# EAGLE design wifi-hat (EAGLE 7.5.0)
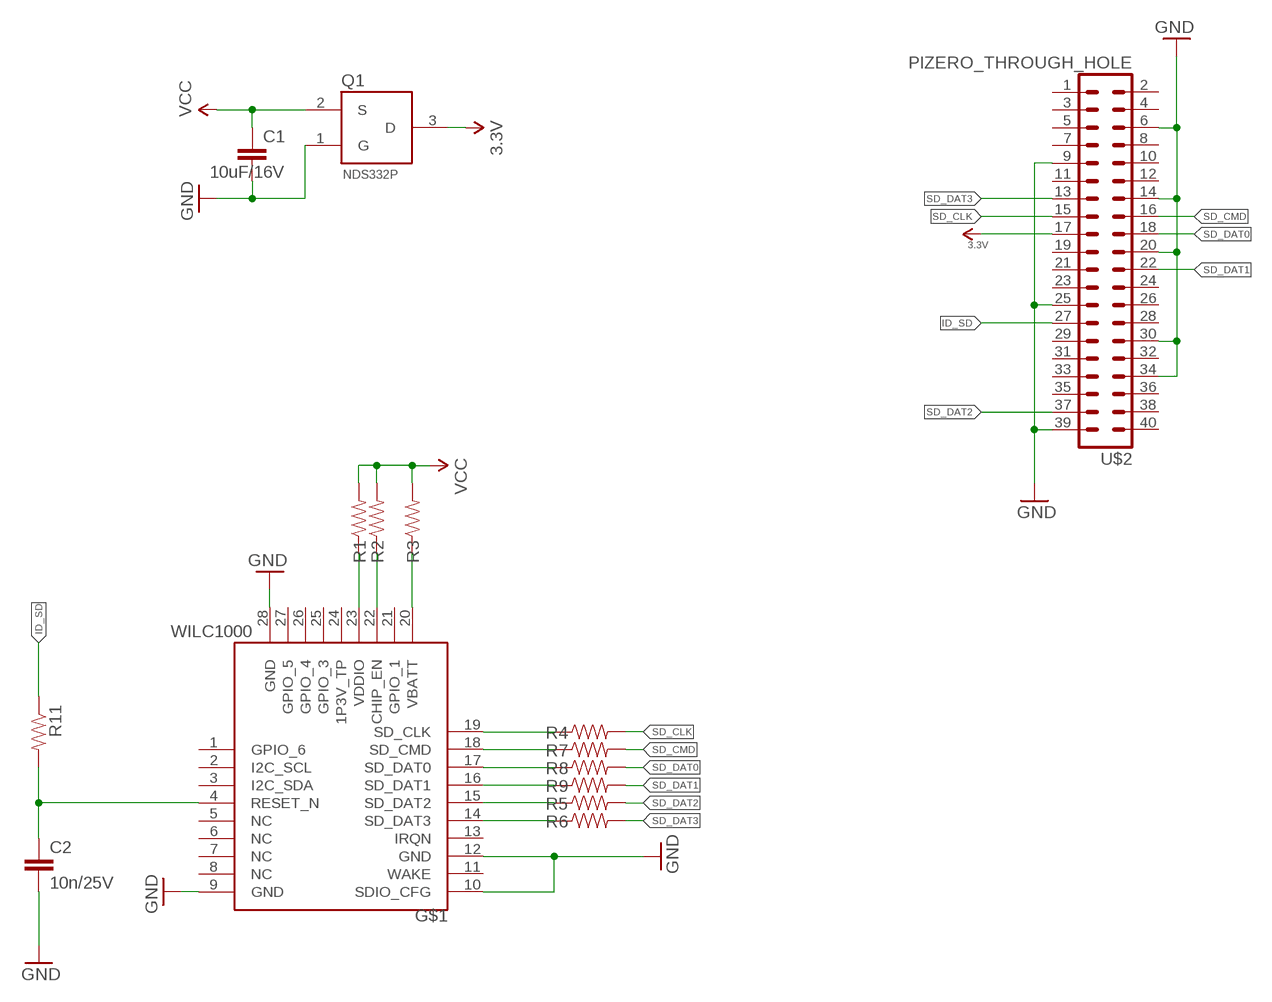
[diagram p0: schematic, sheet 1]

## Parts
C1  10uF/16V  C-EUC0603K  [C0603K]
C2  10n/25V  C-EUC0603K  [C0603K]
Q1  NDS332P  NDS332P-SAG  [SOT23]
R1  0 Ohm  RESISTOR0603-RES  [0603-RES]
R2  1M Ohm  RESISTOR0603-RES  [0603-RES]
R3  0 Ohm  RESISTOR0603-RES  [0603-RES]
R4  75 Ohm  RESISTOR0603-RES  [0603-RES]
R5  75 Ohm  RESISTOR0603-RES  [0603-RES]
R6  75 Ohm  RESISTOR0603-RES  [0603-RES]
R7  75 Ohm  RESISTOR0603-RES  [0603-RES]
R8  75 Ohm  RESISTOR0603-RES  [0603-RES]
R9  75 Ohm  RESISTOR0603-RES  [0603-RES]
R11  1M Ohm  RESISTOR0603-RES  [0603-RES]
U$2  PIZERO_THROUGH_HOLE  [PIZERO_THOUGH_HOLE]
WI_SOC  WILC1000  ATWILC1000-MR110PA  [ATWILC1000-MR110PA]

## Nets
3.3V: Q1.3(D) U$2.17
GND: C1.2 C2.2 Q1.1(G) U$2.6 U$2.9 U$2.14 U$2.20 U$2.25 U$2.30 U$2.34 U$2.39 WI_SOC.9(GND) WI_SOC.10(SDIO_CFG) WI_SOC.12(GND) WI_SOC.28(GND)
ID_SD: R11.1 U$2.27
N$1: R2.1 WI_SOC.22(CHIP_EN)
N$2: R1.1 WI_SOC.23(VDDIO)
N$3: R3.1 WI_SOC.20(VBATT)
N$4: R7.1 WI_SOC.18(SD_CMD)
N$5: R8.1 WI_SOC.17(SD_DAT0)
N$6: R9.1 WI_SOC.16(SD_DAT1)
N$7: R5.1 WI_SOC.15(SD_DAT2)
N$8: R6.1 WI_SOC.14(SD_DAT3)
N$23: R4.1 WI_SOC.19(SD_CLK)
RESET_N: C2.1 R11.2 WI_SOC.4(RESET_N)
SD_CLK: R4.2 U$2.15
SD_CMD: R7.2 U$2.16
SD_DAT0: R8.2 U$2.18
SD_DAT1: R9.2 U$2.22
SD_DAT2: R5.2 U$2.37
SD_DAT3: R6.2 U$2.13
VCC: C1.1 Q1.2(S) R1.2 R2.2 R3.2
Unconnected: U$2.1 U$2.2 U$2.3 U$2.4 U$2.5 U$2.7 U$2.8 U$2.10 U$2.11 U$2.12 U$2.19 U$2.21 U$2.23 U$2.24 U$2.26 U$2.28 U$2.29 U$2.31 U$2.32 U$2.33 U$2.35 U$2.36 U$2.38 U$2.40 WI_SOC.1(GPIO_6) WI_SOC.2(I2C_SCL) WI_SOC.3(I2C_SDA) WI_SOC.5(NC) WI_SOC.6(NC) WI_SOC.7(NC) WI_SOC.8(NC) WI_SOC.11(WAKE) WI_SOC.13(IRQN) WI_SOC.21(GPIO_1) WI_SOC.25(GPIO_3) WI_SOC.26(GPIO_4) WI_SOC.27(GPIO_5)

## Power pins joined to a net without a drawn wire
1P3V_TP: WI_SOC.24(1P3V_TP)

## Library data of the parts
C1 C2 = resistor:C-EU: CAPACITOR, European symbol
Q1 = wifi-hat:NDS332P
R1-R9 R11 = SparkFun-Resistors:RESISTOR: Resistor Basic schematic elements and footprints for 0603, 1206, and PTH resistors.
U$2 = pizero:PIZERO_THROUGH_HOLE
WI_SOC = wilc1000:ATWILC1000-MR110PA: IEEE 802.11 b/g/n Link Controller SoC

## Board
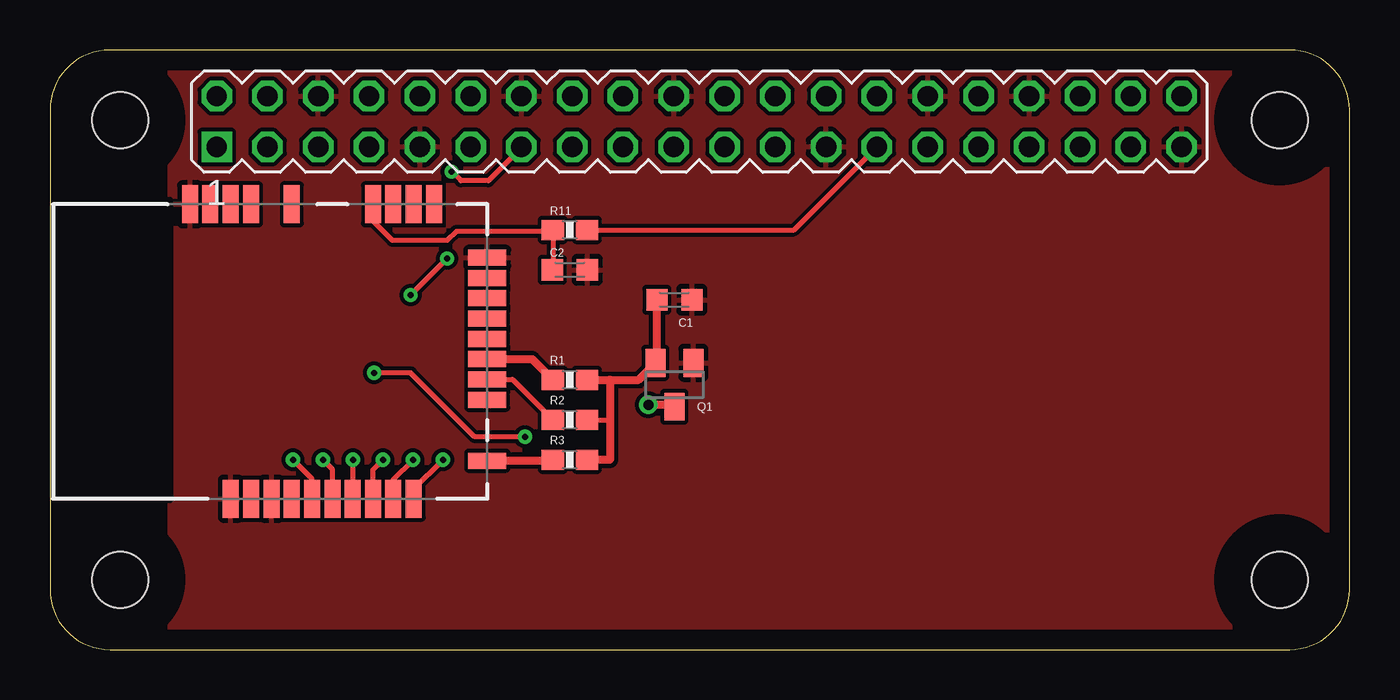
[diagram p1: board, top side]
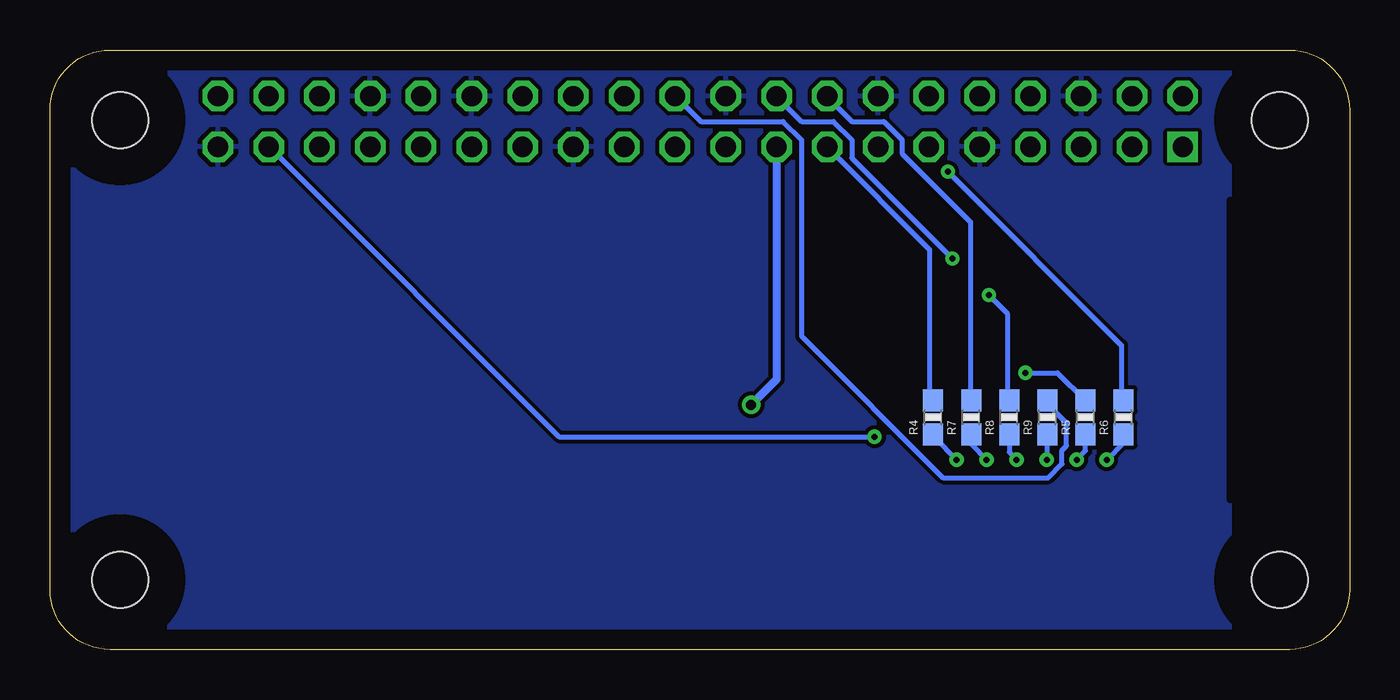
[diagram p2: board, bottom side, seen from below]

Size 65 x 30 mm. Coordinates in mm from the lower left corner, seen from the top.
Copper layers (1*16): Top 0.035mm / dielectric 1.5mm / Bottom 0.035mm
Design rules "default": minimum track width 10mil, minimum drill 24mil, track to track 8mil, track to pad 8mil, pad to pad 8mil, via to via 8mil, smd to smd 8mil, copper to edge 40mil, drill to drill 8mil, minimum pad ring 10mil, minimum via ring 8mil, stop-mask expansion 4mil, vias tented up to drill 0mil, thermal gap 10mil
tRestrict: area 0,7.5 to 6,22.5
bRestrict: area 0,7.5 to 6,22.5
vRestrict: area 0,7.5 to 6,22.5

### Footprints (pad centres in the part's own frame; a part is rotated, then mirrored left to right if it is on the bottom)
C0603K = smd 1.05 x 1.08: 1 -0.875,0; 2 0.875,0
SOT23 = smd 1 x 1.4: 1 -0.95,-1.1; 2 0.95,-1.1; 3 0,1.1
0603-RES = smd 1.1 x 1: 1 -0.85,0; 2 0.85,0
PIZERO_THOUGH_HOLE = drill 1.016 square: 1 8.34,25.15 | drill 1.016 octagon: 2 8.34,27.69; 3 10.88,25.15; 4 10.88,27.69; 5 13.42,25.15; 6 13.42,27.69; 7 15.96,25.15; 8 15.96,27.69; 9 18.5,25.15; 10 18.5,27.69; 11 21.04,25.15; 12 21.04,27.69; 13 23.58,25.15; 14 23.58,27.69; 15 26.12,25.15; 16 26.12,27.69; 17 28.66,25.15; 18 28.66,27.69; 19 31.2,25.15; 20 31.2,27.69; 21 33.74,25.15; 22 33.74,27.69; 23 36.28,25.15; 24 36.28,27.69; 25 38.82,25.15; 26 38.82,27.69; 27 41.36,25.15; 28 41.36,27.69; 29 43.9,25.15; 30 43.9,27.69; 31 46.44,25.15; 32 46.44,27.69; 33 48.98,25.15; 34 48.98,27.69; 35 51.52,25.15; 36 51.52,27.69; 37 54.06,25.15; 38 54.06,27.69; 39 56.6,25.15; 40 56.6,27.69 | hole 2.8: 3.5,3.5; 3.5,26.5; 61.5,26.5; 61.5,3.5
ATWILC1000-MR110PA = smd 0.8 x 1.9: 1 2.67,0; 2 3.686,0; 3 4.702,0; 4 5.718,0; 5 9.782,0; 6 11.814,0; 7 12.83,0; 8 13.846,0; 9 14.862,0; 10 12.824,14.73; 11 11.808,14.73; 12 10.792,14.73; 13 9.776,14.73; 14 8.76,14.73; 15 7.744,14.73; 16 6.728,14.73; 17 5.712,14.73; 18 4.696,14.73; 19 3.68,14.73 | smd 1.9 x 0.8: 20 0,12.83; 21 0,9.782; 22 0,8.766; 23 0,7.75; 24 0,6.734; 25 0,5.718; 26 0,4.702; 27 0,3.686; 28 0,2.67

### Placement (x,y rotation side)
C1  31.23,17.5 0 top
C2  26,19 0 top
Q1  31.23,13.25 180 top
R1  26,13.5 0 top
R2  26,11.5 0 top
R3  26,9.5 0 top
R4  20.83,11.62 90 bottom
R5  13.21,11.62 90 bottom
R6  11.31,11.62 90 bottom
R7  18.92,11.62 90 bottom
R8  17.02,11.62 90 bottom
R9  15.11,11.62 90 bottom
R11  26,21 180 top
U$2  0,0 0 top
WI_SOC  21.87,22.28 180 top

### Tracks (layer width: path | path; a pad name or v marks a point on that pad's centre or on a via)
3.3V  (via drill 0.5)
  Top 0.254: 31.07,12.25 Q1.3
  Top 0.406: 31.07,12.25 v29.93,12.25
  Bottom 0.406: U$2.17 28.66,13.52 v29.93,12.25
GND
  pour Top (isolate 0.16): 6,0 6,30 62.5,30 arc-90 65,27.5 65,2.5 arc-90 62.5,0
  pour Bottom (isolate 0.16): 6,0 6,30 62.5,30 arc-90 65,27.5 65,2.5 arc-90 62.5,0
ID_SD
  Top 0.254: R11.1 37.21,21 U$2.27
N$1
  Top 0.254: WI_SOC.22 23.14,13.51 R2.1
N$2
  Top 0.406: WI_SOC.23 24.12,14.53 R1.1
N$3
  Top 0.406: WI_SOC.20 25.1,9.45 R3.1
N$4  (via drill 0.3)
  Top 0.254: WI_SOC.18 17.17,8.52 v18.15,9.5
  Bottom 0.254: R7.1 18.92,10.27 v18.15,9.5
N$5  (via drill 0.3)
  Top 0.254: WI_SOC.17 16.16,9.01 v16.65,9.5
  Bottom 0.254: R8.1 17.02,9.87 v16.65,9.5
N$6  (via drill 0.3)
  Top 0.254: WI_SOC.16 v15.15,9.5
  Bottom 0.254: 15,10.77 R9.1 15.15,10.73 v15.15,9.5
N$7  (via drill 0.3)
  Top 0.254: WI_SOC.15 14.13,9.02 v13.65,9.5
  Bottom 0.254: v13.65,9.5 13.21,9.94 R5.1
N$8  (via drill 0.3)
  Top 0.254: WI_SOC.14 13.11,8.54 v12.15,9.5
  Bottom 0.254: R6.1 11.31,10.34 v12.15,9.5
N$23  (via drill 0.3)
  Top 0.254: WI_SOC.19 18.19,8.04 v19.65,9.5
  Bottom 0.254: R4.1 20.77,10.77 20.77,10.62 v19.65,9.5
RESET_N
  Top 0.254: WI_SOC.4 16.21,22.08 16.21,21.39 17.12,20.48 19.87,20.48 20.33,20.94 25.09,20.94 R11.2 25.15,19.02 C2.1
SD_CLK
  Bottom 0.254: R4.2 21.01,12.48 21.01,20.02 26.04,25.05 U$2.15
SD_CMD
  Bottom 0.254: R7.2 18.95,12.48 18.95,21.39 22.38,24.82 22.38,25.51 23.3,26.42 24.9,26.42 26.04,27.56 U$2.16
SD_DAT0  (via drill 0.3)
  Top 0.254: v19.87,19.56 v18.04,17.74
  Bottom 0.254: v18.04,17.74 17.12,16.82 17.12,12.48 R8.2 | v19.87,19.56 24.9,24.59 24.9,25.51 25.81,26.42 27.41,26.42 28.56,27.56 U$2.18
SD_DAT1
  Bottom 0.254: R9.2 15.07,12.25 14.15,11.34 14.15,10.19 14.38,9.96 14.38,9.28 15.07,8.59 20.33,8.59 27.41,15.68 27.41,25.51 28.33,26.42 32.44,26.42 33.58,27.56 U$2.22
SD_DAT2  (via drill 0.3)
  Top 0.254: v16.21,13.85 18.04,13.85 21.24,10.65 v23.75,10.65
  Bottom 0.254: v16.21,13.85 14.61,13.85 13.24,12.48 R5.2 | v23.75,10.65 39.53,10.65 53.93,25.05 U$2.37
SD_DAT3  (via drill 0.3)
  Top 0.254: v20.1,23.91 20.55,23.45 21.92,23.45 23.53,25.05 U$2.13
  Bottom 0.254: v20.1,23.91 11.41,15.22 11.41,12.48 R6.2
VCC
  Top 0.254: R2.2 28,11.5 | 30.38,14.53 Q1.2
  Top 0.406: R1.2 28,13.5 | 28,13.5 28,11.5 28,9.5 R3.2 | 28,13.5 29.44,13.5 Q1.2 | 30.38,14.53 30.36,14.53 C1.1